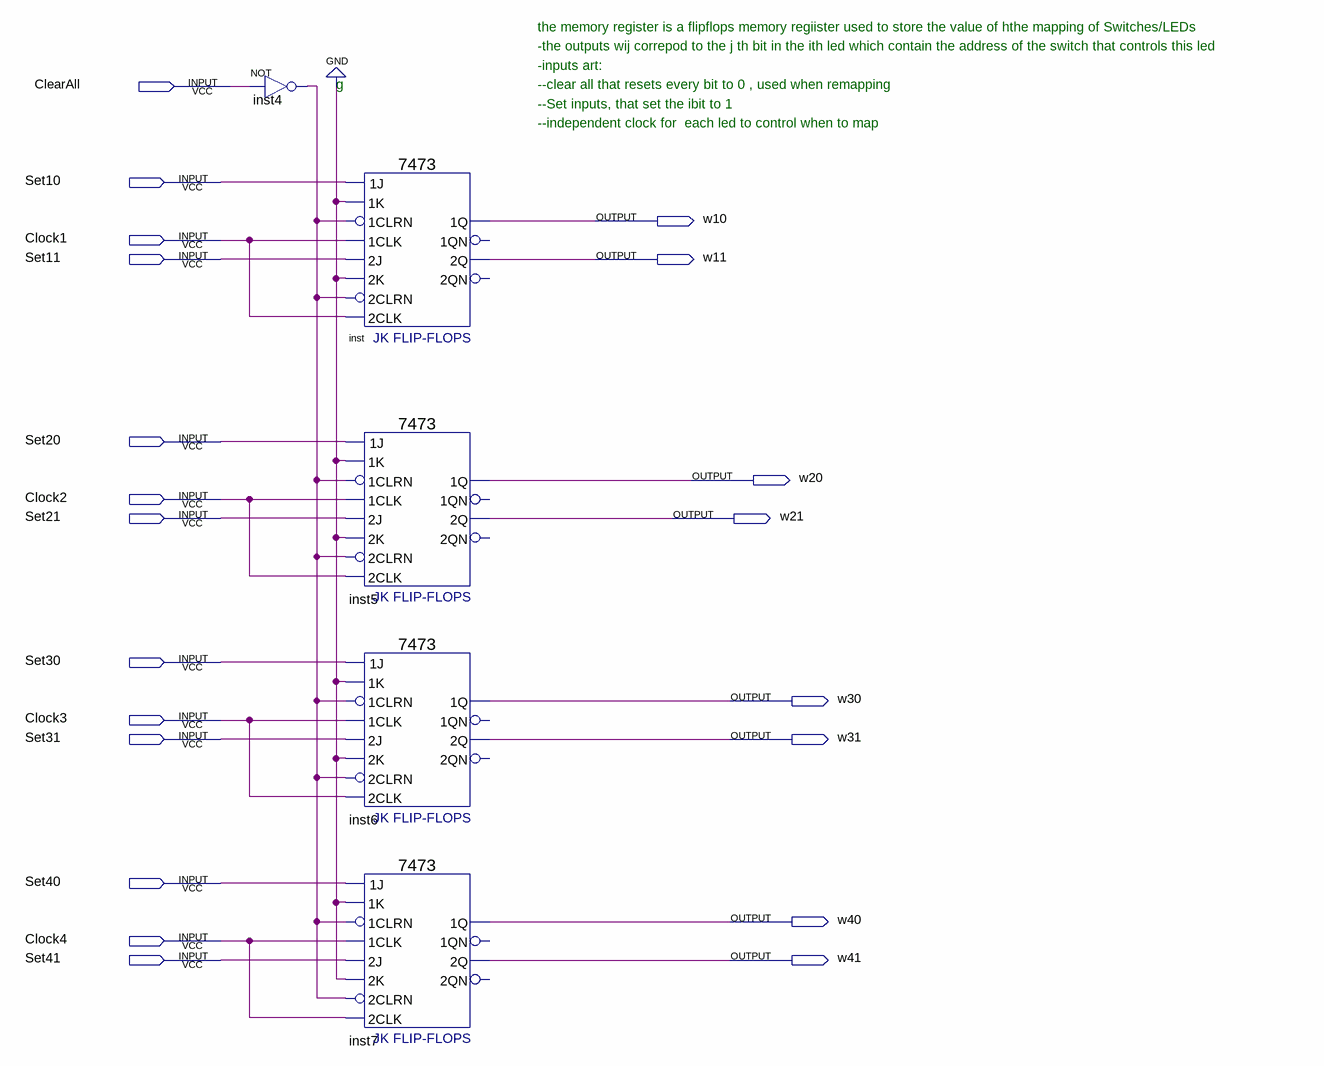
[diagram p0: schematic sheet]
// Quartus schematic MemoryRegister.bdf as structural Verilog: 5 symbols, 21 pins
module MemoryRegister (
  input  ClearAll,
  input  Set10,
  input  Clock1,
  input  Set11,
  input  Set20,
  input  Clock2,
  input  Set21,
  input  Set30,
  input  Clock3,
  input  Set31,
  input  Set40,
  input  Clock4,
  input  Set41,
  output w10,
  output w11,
  output w20,
  output w21,
  output w30,
  output w31,
  output w40,
  output w41
);

  wire inst4_out;

  not inst4 (inst4_out, ClearAll);
  \7473  inst (
    .\1J (Set10), .\1CLRN (inst4_out), .\1K (1'b0), .\1CLK (Clock1), .\2J (Set11), .\2CLK (Clock1),
    .\2CLRN (inst4_out), .\2K (1'b0), .\2Q (w11), .\1Q (w10));  // open: 1QN, 2QN
  \7473  inst5 (
    .\1J (Set20), .\1CLRN (inst4_out), .\1K (1'b0), .\1CLK (Clock2), .\2J (Set21), .\2CLK (Clock2),
    .\2CLRN (inst4_out), .\2K (1'b0), .\2Q (w21), .\1Q (w20));  // open: 1QN, 2QN
  \7473  inst6 (
    .\1J (Set30), .\1CLRN (inst4_out), .\1K (1'b0), .\1CLK (Clock3), .\2J (Set31), .\2CLK (Clock3),
    .\2CLRN (inst4_out), .\2K (1'b0), .\2Q (w31), .\1Q (w30));  // open: 1QN, 2QN
  \7473  inst7 (
    .\1J (Set40), .\1CLRN (inst4_out), .\1K (1'b0), .\1CLK (Clock4), .\2J (Set41), .\2CLK (Clock4),
    .\2CLRN (inst4_out), .\2K (1'b0), .\2Q (w41), .\1Q (w40));  // open: 1QN, 2QN

  // Notes on the sheet:
  //   the memory register is a flipflops memory regiister used to store the value of hthe mapping of Switches/LEDs
  //   -the outputs wij correpod to the j th bit in the ith led which contain the address of the switch that controls this led
  //   -inputs art:
  //   g
  //   --clear all that resets every bit to 0 , used when remapping
  //   --Set inputs, that set the ibit to 1
  //   --independent clock for  each led to control when to map
endmodule
